# EasyEDA schematic SCH_interrupt-proof-of-concept_2025-12-12.json
TITLE: Sheet_1; REV: 1.0; Date: 2025-12-12; Sheet: 1/1; Drawn By: rubenvl3; Company: Your Company
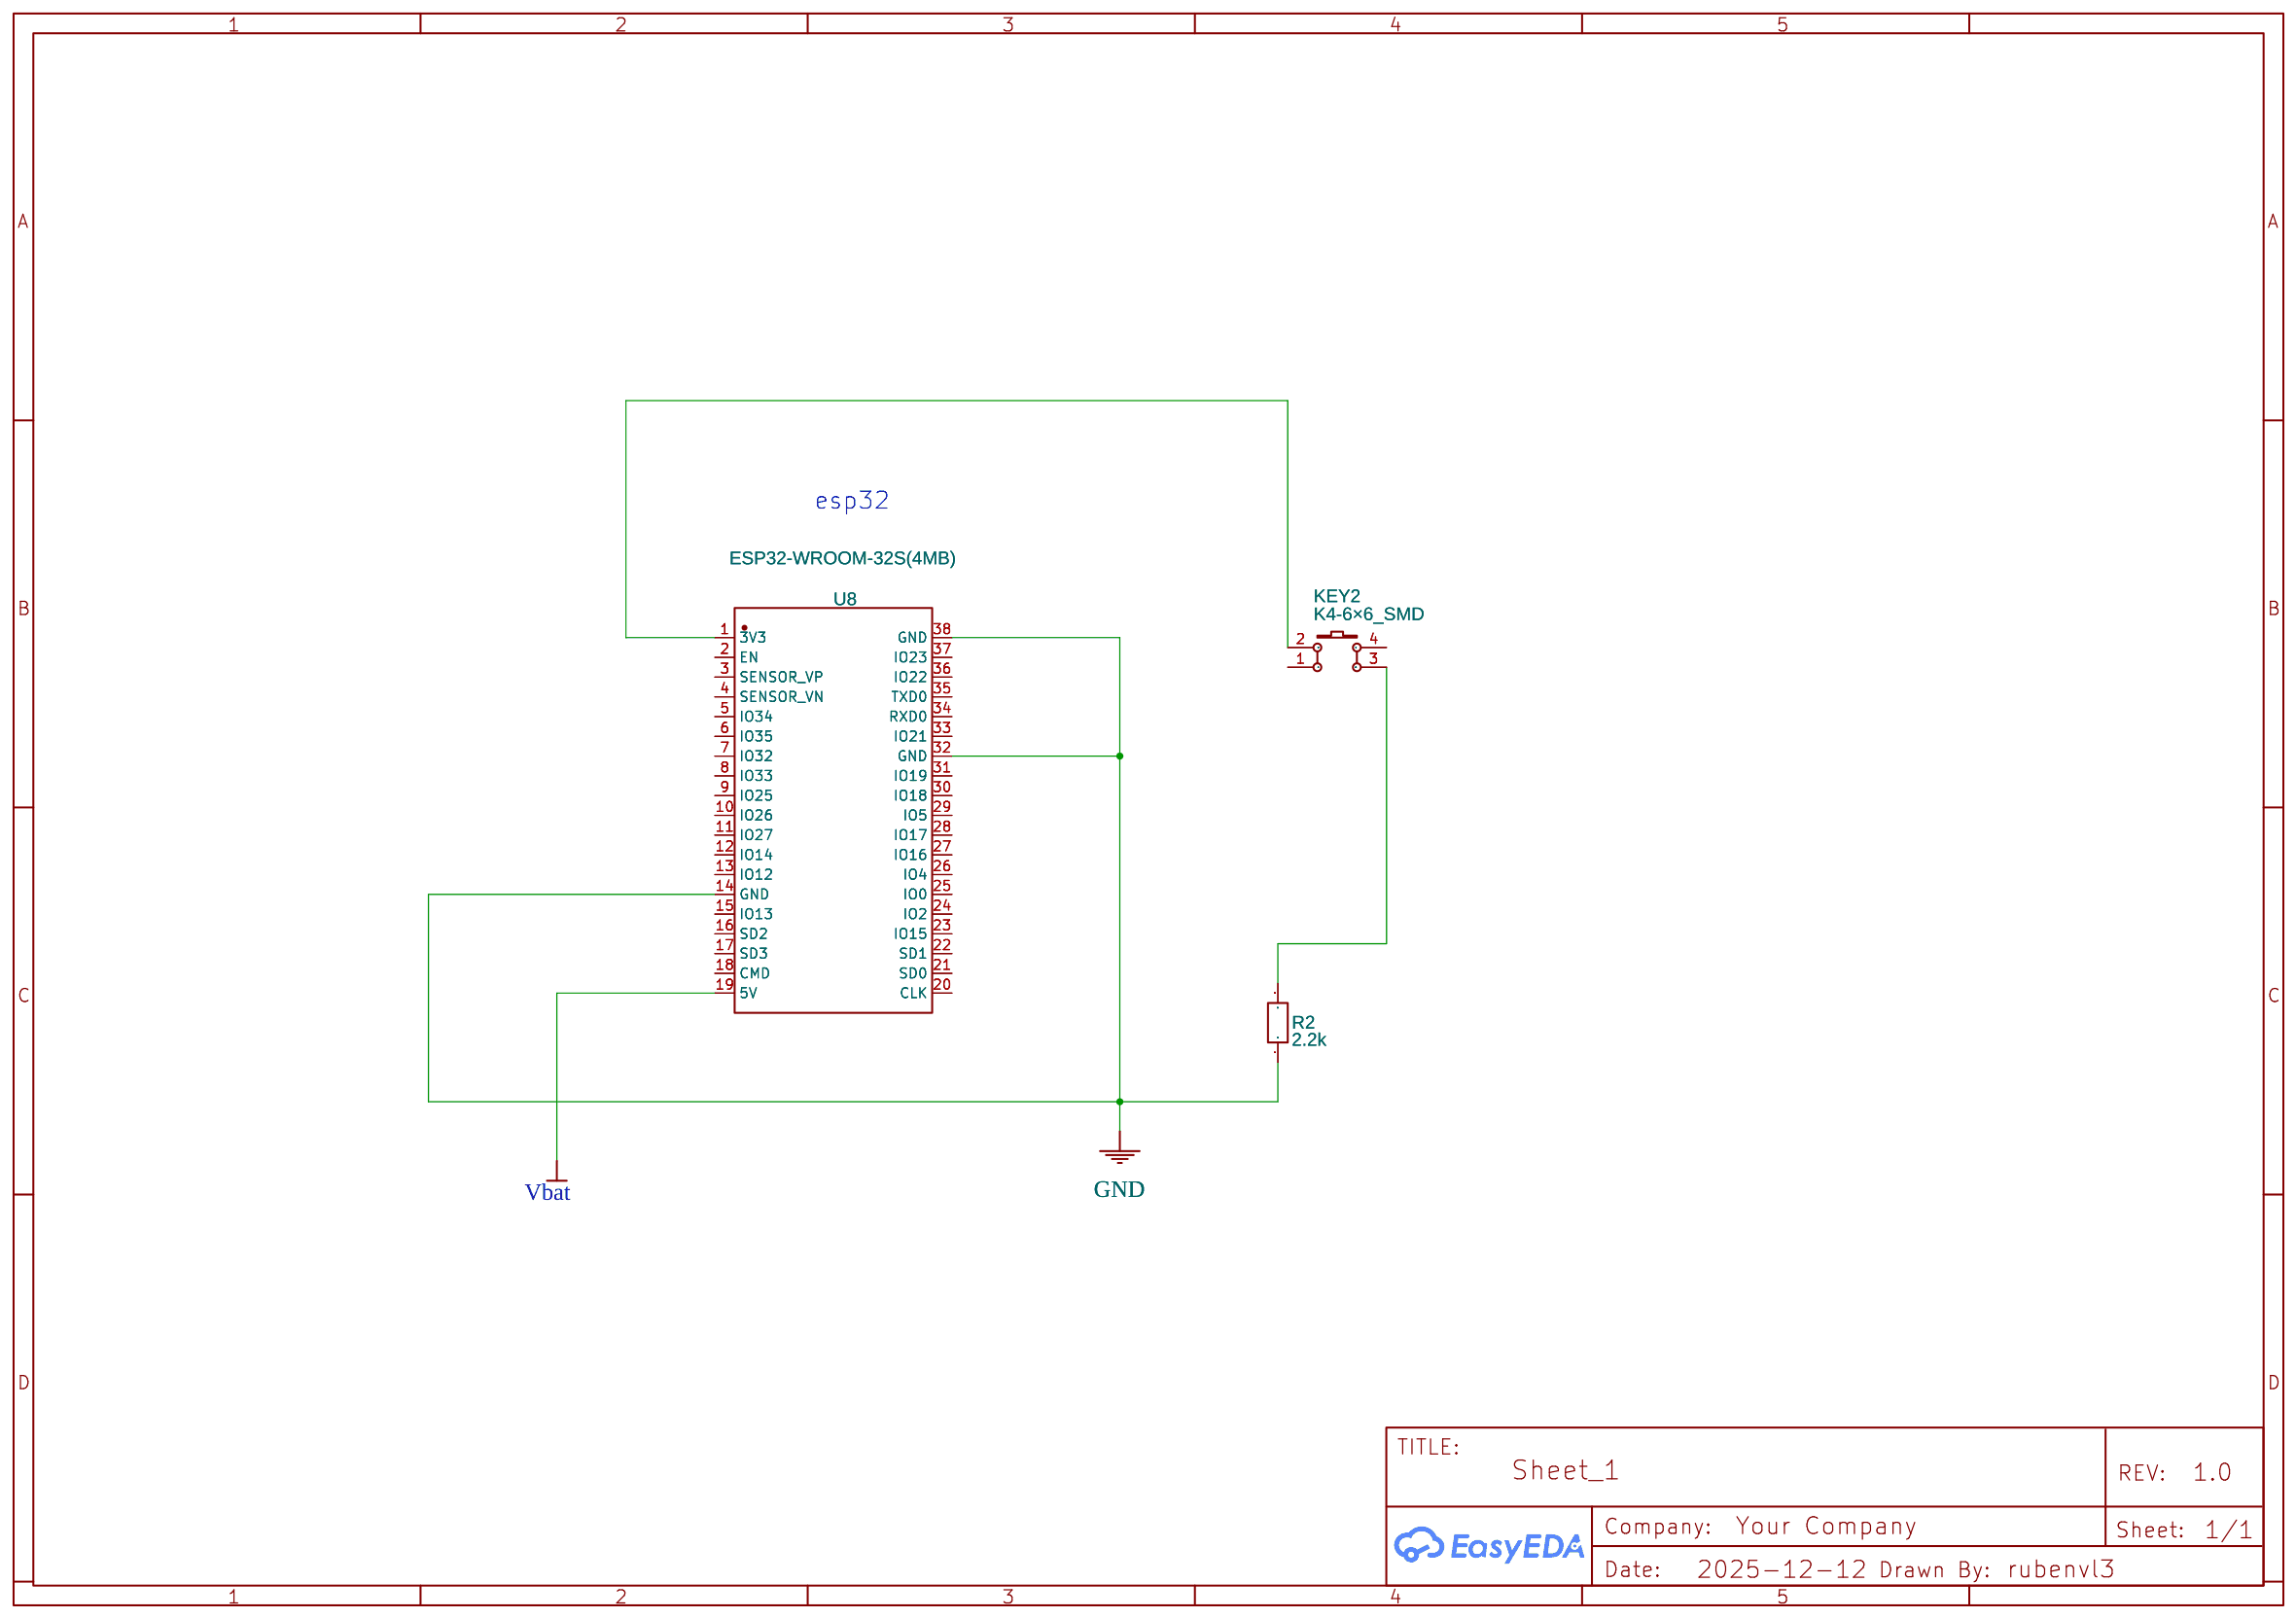
[diagram p0: schematic sheet]

## Parts
KEY2  K4-6×6_SMD  [KEY-SMD_4P-L6.0-W6.0-P4.50-LS8.6]
R2  2.2k  [R0805]
U8  ESP32-WROOM-32S(4MB)  [WIFIM-SMD_39P-L19.2-W18.0-P1.27]

## Library data of the parts
KEY2 = K4-6×6_SMD: Supplier Part: C191626; Supplier: LCSC; Manufacturer: 韩国韩荣; Manufacturer Part: K2-6639SP-D4SC-04; Contributor: LCEDA_Lib
R2 = R_0805_EU: Contributor: LCEDA_Lib
U8 = ESP32-WROOM-32S(4MB): Supplier: LCSC; Supplier Part: C529580; Manufacturer: Espressif Systems; Contributor: Aaron Hentschel; JLCPCB Part Class: Extended Part

## Nets
GND: R2.1 U8.14(GND) U8.32(GND) U8.38(GND)
Vbat: U8.19(5V)
Net-(KEY2-2): KEY2.2 U8.1(3V3)
Net-(KEY2-3): KEY2.3 R2.2

Not connected (* = marked no-connect by the designer): KEY2 1 4; U8 2(EN) 3(SENSOR_VP) 4(SENSOR_VN) 5(IO34) 6(IO35) 7(IO32) 8(IO33) 9(IO25) 10(IO26) 11(IO27) 12(IO14) 13(IO12) 15(IO13) 16(SD2) 17(SD3) 18(CMD) 20(CLK) 21(SD0) 22(SD1) 23(IO15) 24(IO2) 25(IO0) 26(IO4) 27(IO16) 28(IO17) 29(IO5) 30(IO18) 31(IO19) 33(IO21) 34(RXD0) 35(TXD0) 36(IO22) 37(IO23)

## Notes on the sheet
- esp32
